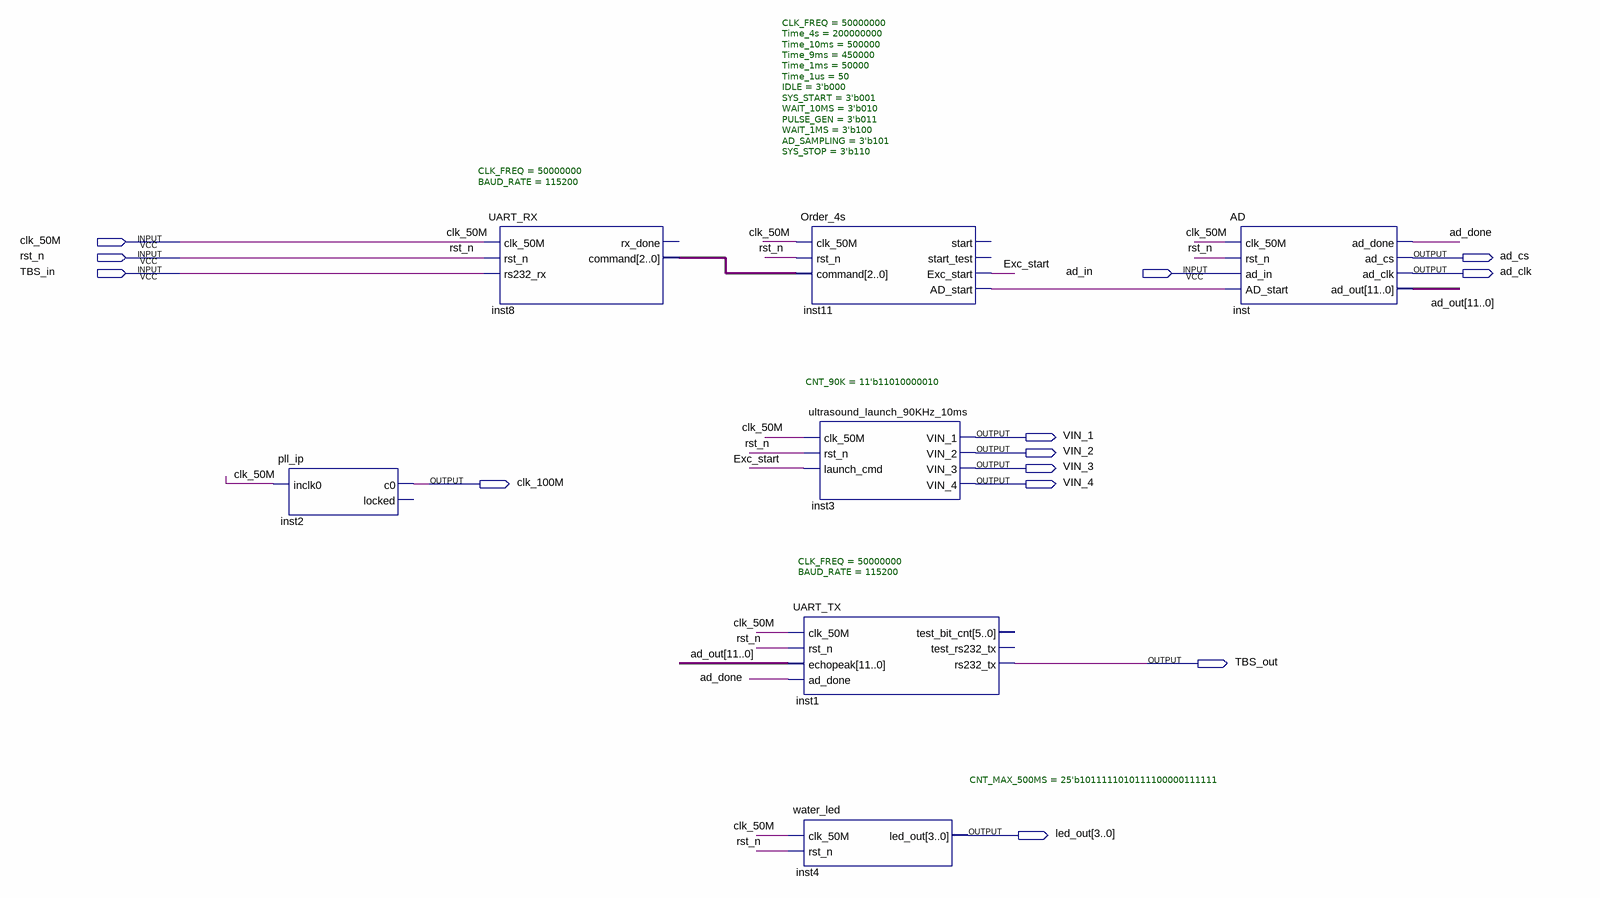
[diagram p0: schematic sheet]
// Quartus schematic Underground_section.bdf as structural Verilog: 7 symbols, 13 pins
module Underground_section (
  input  clk_50M,
  input  rst_n,
  input  TBS_in,
  input  ad_in,
  output ad_cs,
  output ad_clk,
  output VIN_1,
  output VIN_2,
  output VIN_3,
  output clk_100M,
  output VIN_4,
  output TBS_out,
  output [3:0] led_out
);

  wire ad_done, Exc_start, inst11_ad_start;
  wire [2:0] inst8_command;
  wire [11:0] ad_out;

  pll_ip inst2 (.inclk0(clk_50M), .c0(clk_100M));  // open: locked
  UART_RX #(.CLK_FREQ(50000000), .BAUD_RATE(115200)) inst8 (
    .clk_50M(clk_50M), .rst_n(rst_n), .rs232_rx(TBS_in), .command(inst8_command));  // open: rx_done
  Order_4s #(.CLK_FREQ(50000000), .Time_4s(200000000), .Time_10ms(500000), .Time_9ms(450000), .Time_1ms(50000), .Time_1us(50), .IDLE(3'b000), .SYS_START(3'b001), .WAIT_10MS(3'b010), .PULSE_GEN(3'b011), .WAIT_1MS(3'b100), .AD_SAMPLING(3'b101), .SYS_STOP(3'b110)) inst11 (
    .clk_50M(clk_50M), .rst_n(rst_n), .command(inst8_command), .Exc_start(Exc_start),
    .AD_start(inst11_ad_start));  // open: start, start_test
  ultrasound_launch_90KHz_10ms #(.CNT_90K(11'b11010000010)) inst3 (
    .clk_50M(clk_50M), .rst_n(rst_n), .launch_cmd(Exc_start), .VIN_1(VIN_1), .VIN_2(VIN_2), .VIN_3(VIN_3),
    .VIN_4(VIN_4));
  UART_TX #(.CLK_FREQ(50000000), .BAUD_RATE(115200)) inst1 (
    .clk_50M(clk_50M), .rst_n(rst_n), .echopeak(ad_out), .ad_done(ad_done), .rs232_tx(TBS_out));  // open: test_bit_cnt, test_rs232_tx
  water_led #(.CNT_MAX_500MS(25'b1011111010111100000111111)) inst4 (
    .clk_50M(clk_50M), .rst_n(rst_n), .led_out(led_out));
  AD inst (
    .clk_50M(clk_50M), .rst_n(rst_n), .ad_in(ad_in), .AD_start(inst11_ad_start), .ad_done(ad_done),
    .ad_cs(ad_cs), .ad_clk(ad_clk), .ad_out(ad_out));
endmodule
